# EAGLE design opendtu (EAGLE 7.7.0)
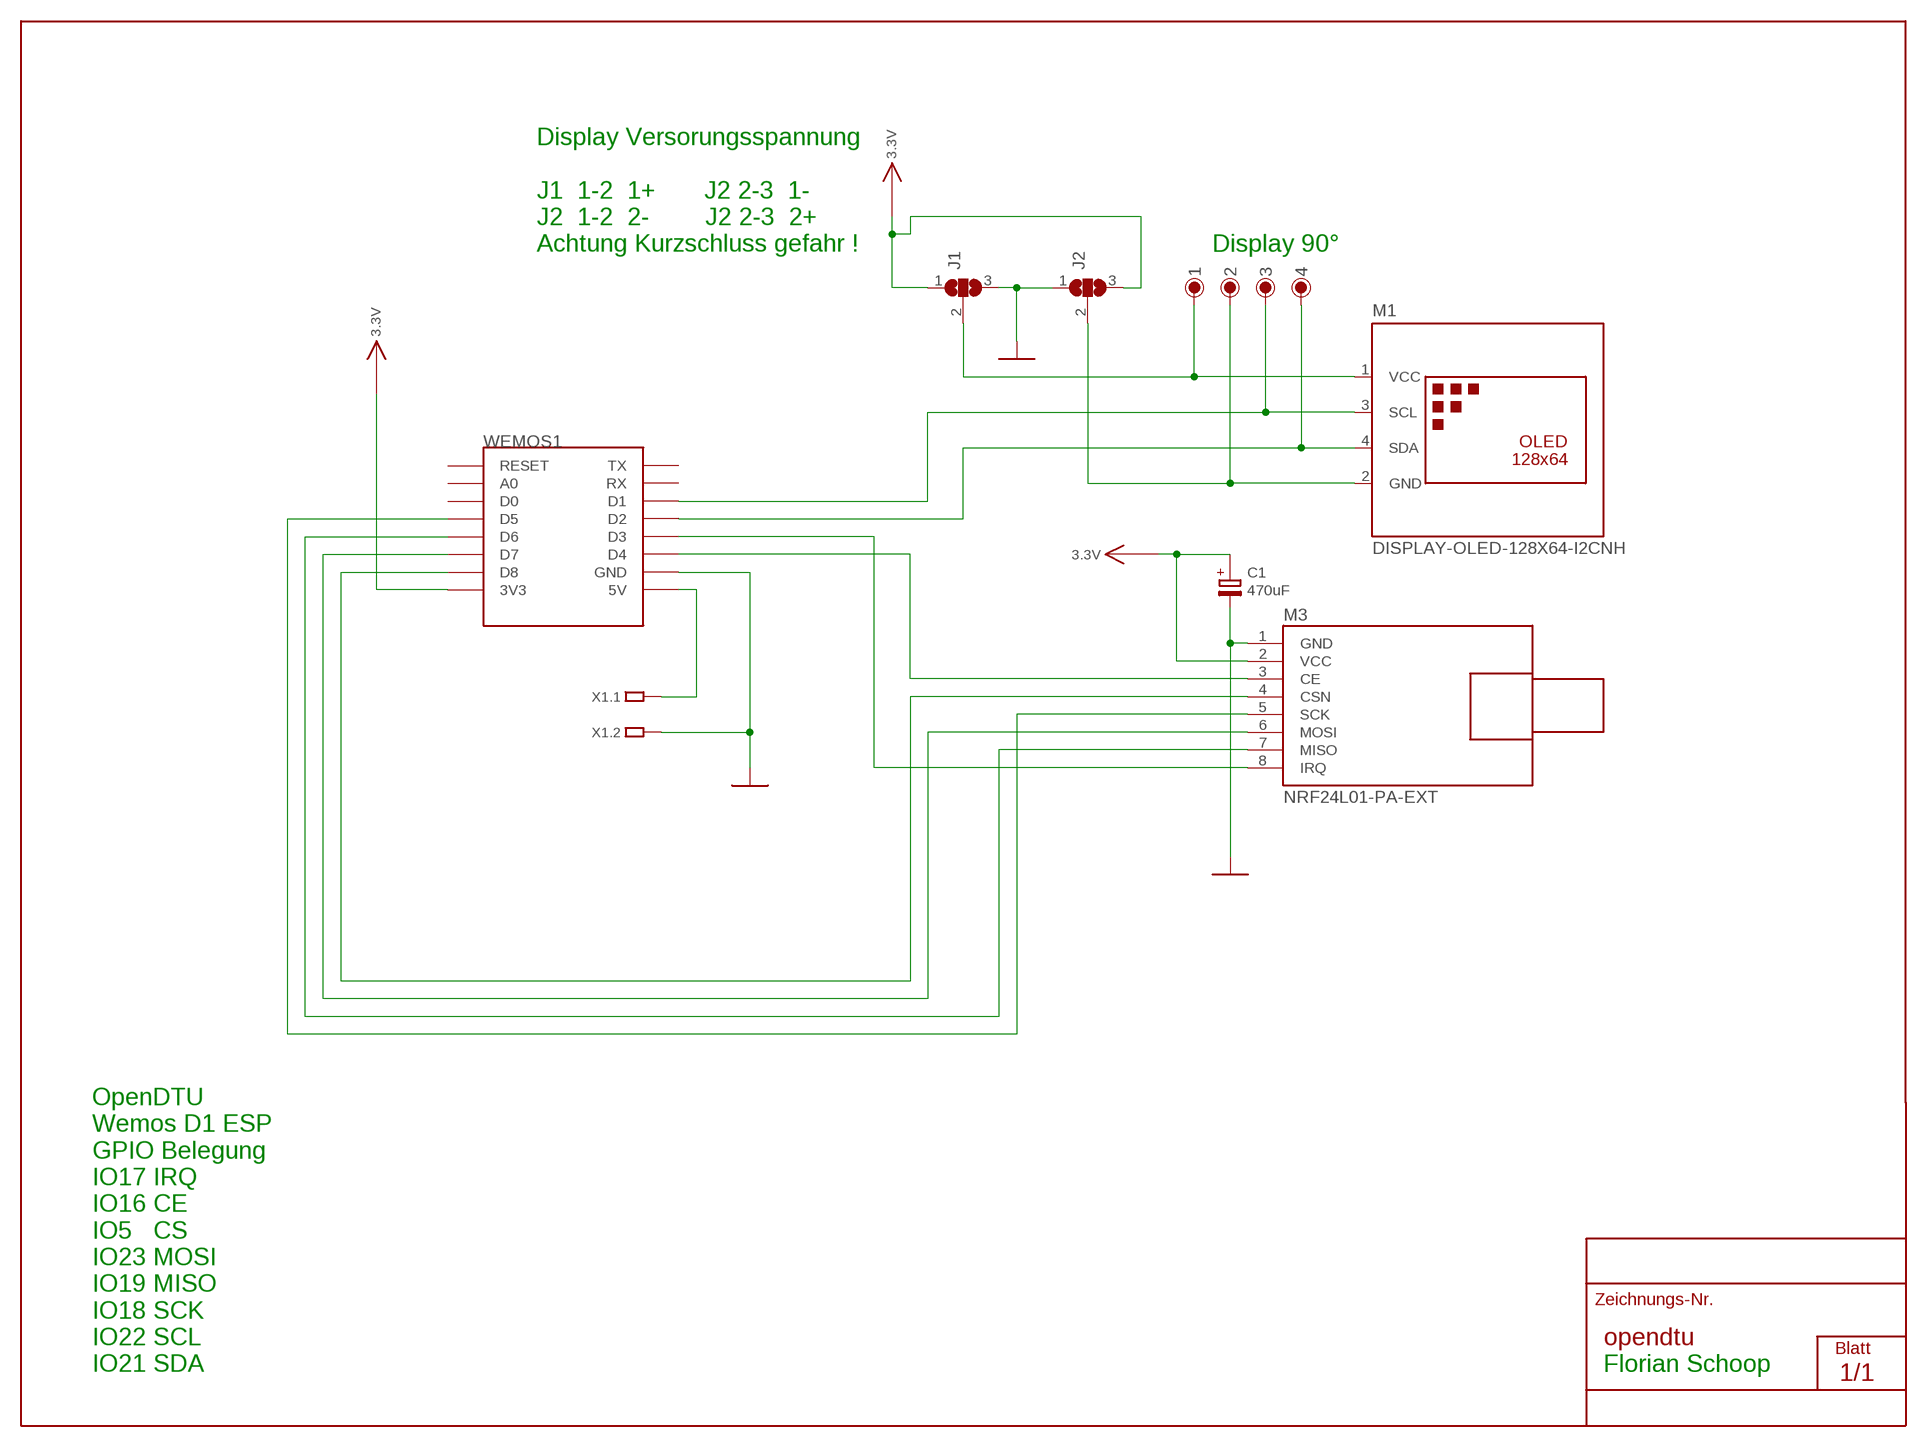
[diagram p0: schematic, sheet 1]

## Parts
1  PINGERAD  [PINGERAD]
2  PINGERAD  [PINGERAD]
3  PINGERAD  [PINGERAD]
4  PINGERAD  [PINGERAD]
C1  470uF  S470µ/16  [EB10D]
J1  SJ2W  [SJ_2]
J2  SJ2W  [SJ_2]
M1  DISPLAY-OLED-128X64-I2CNH  [DISPLAY-OLED-128X64-I2C_NH]
M3  NRF24L01-PA-EXT  [NRF24L01-PA-EXT]
WEMOS1  WEMOS-D1-MINI  [WEMOS-D1-MINI]
X1  MCV1,5/2G  [MCV1,5/2]

## Nets
+3.3V: C1.+ J1.1 J2.3 M3.2(VCC) WEMOS1.3V3 ; supply symbol labelled 3.3V
GND: C1.- J1.3 J2.1 M3.1(GND) WEMOS1.GND X1.2
N$1: 4.1 M1.4(SDA) WEMOS1.D2
N$2: 3.1 M1.3(SCL) WEMOS1.D1
N$3: 2.1 J2.2 M1.2(GND)
N$4: 1.1 J1.2 M1.1(VCC)
N$5: M3.3(CE) WEMOS1.D4
N$6: M3.4(CSN) WEMOS1.D8
N$7: M3.6(MOSI) WEMOS1.D7
N$8: M3.7(MISO) WEMOS1.D6
N$9: M3.5(SCK) WEMOS1.D5
N$11: M3.8(IRQ) WEMOS1.D3
N$12: WEMOS1.5V X1.1
Unconnected: WEMOS1.A0 WEMOS1.D0 WEMOS1.RESET WEMOS1.RX WEMOS1.TX

## Notes on the sheet
- Display Versorungsspannung
  
  J1  1-2  1+       J2 2-3  1-
  J2  1-2  2-        J2 2-3  2+
  Achtung Kurzschluss gefahr !
- Display 90°
- OpenDTU 
  Wemos D1 ESP
  GPIO Belegung
  IO17 IRQ
  IO16 CE
  IO5   CS
  IO23 MOSI
  IO19 MISO
  IO18 SCK
  IO22 SCL
  IO21 SDA
- Florian Schoop

## Library data of the parts
1-4 = 3PASSIVE:PINGERAD
C1 = 5elko:S470µ/16
J1 J2 = jumper_fs:SJ2W: SMD solder JUMPER
M1 = EYR_Displays:DISPLAY-OLED-128X64-I2C: 128x64 Dot Matrix OLED Module based on SSD1306 chip Variant with I2C interface
M3 = EYR_Modulos:NRF24L01-PA-EXT: 2.4 GHz Wireless Module based on NRF24L01 chip with preamplifier and external antenna
WEMOS1 = wemos d1:WEMOS-D1-MINI: WeMos.cc D1 mini ESP8266 module
X1 = STECKER:MCV1,5/2G

## Board
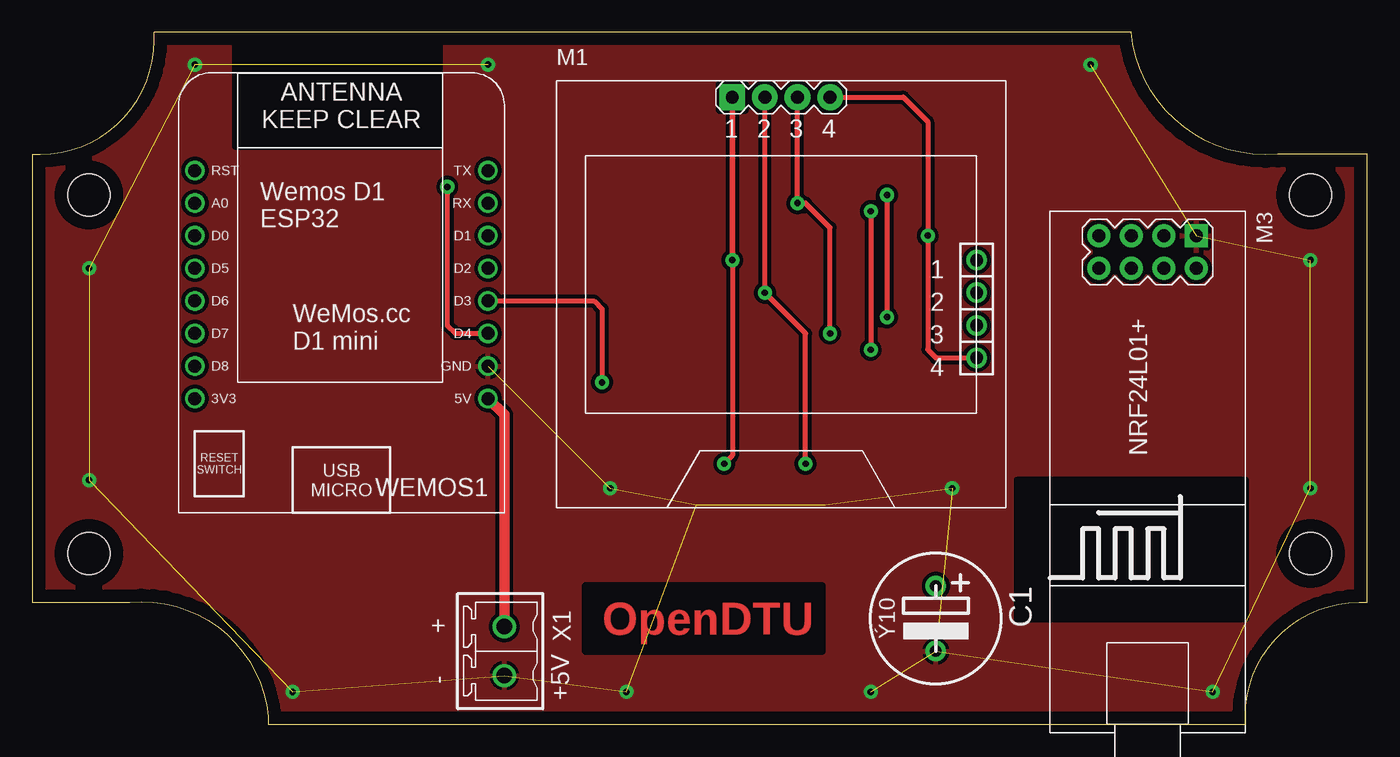
[diagram p1: board, top side]
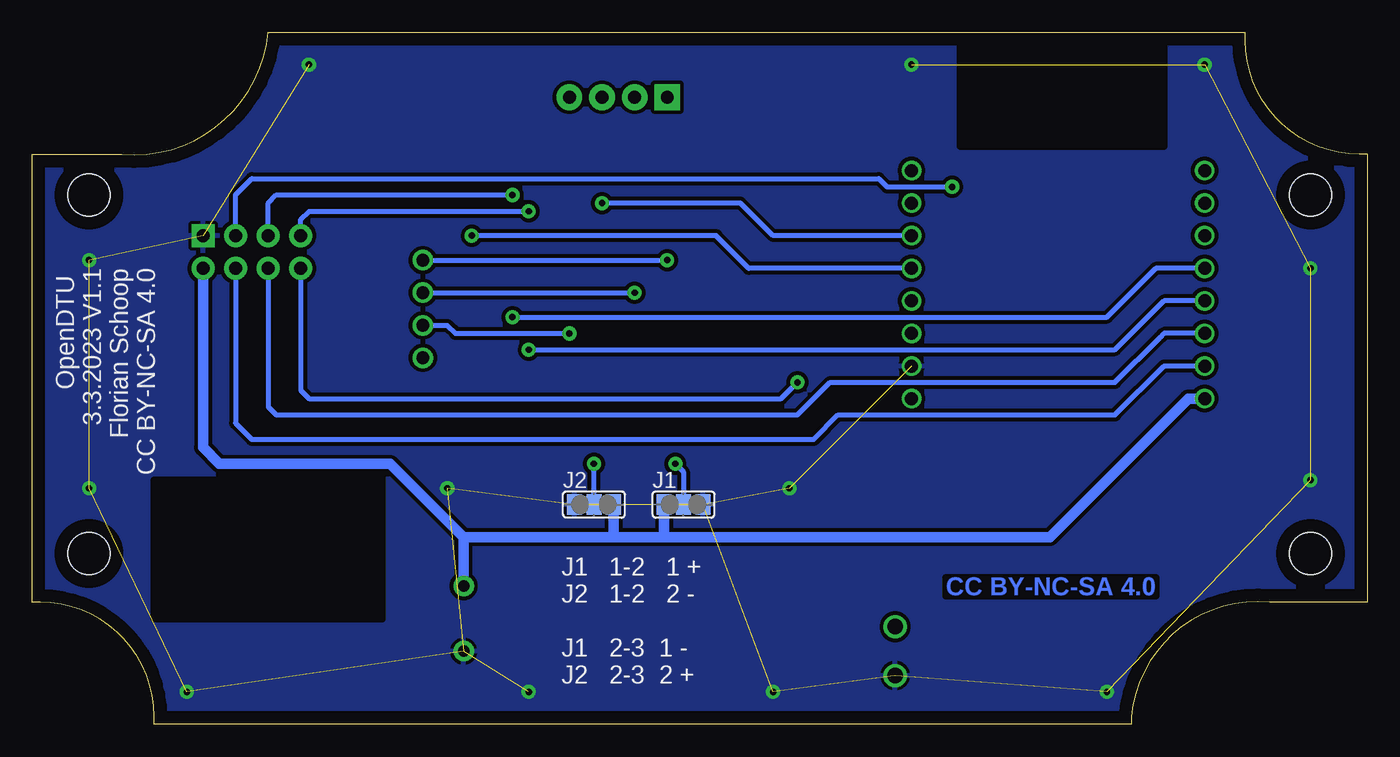
[diagram p2: board, bottom side, seen from below]

Size 104.14 x 53.98 mm. Coordinates in mm from the lower left corner, seen from the top.
Outline: 104.14,9.53 104.14,44.45 97.16,44.45 arc-90 85.72,53.98 9.53,53.98 9.53,53.34 arc-90 0.64,44.45 0,44.45 0,9.53 7.62,9.53 arc-90 18.41,0.64 18.41,0 94.61,0 94.61,0.64 arc-90 103.5,9.53 104.14,9.53
Copper layers (1*16): Component 0.035mm / dielectric 1.5mm / Solder 0.035mm
Design rules "default": minimum track width 10mil, minimum drill 0.6mm, track to track 8mil, track to pad 8mil, pad to pad 8mil, via to via 8mil, smd to smd 8mil, copper to edge 40mil, drill to drill 8mil, minimum pad ring 10mil, minimum via ring 8mil, stop-mask expansion 4mil, vias tented up to drill 0mil, thermal gap 10mil
Holes 3.3 mm at 4.45,41.27 4.45,13.34 99.69,41.27 99.69,13.34
tRestrict: area 15.9,45.1 to 31.7,54; area 76.8,8.3 to 94.6,19; area 43.2,5.7 to 61.6,10.8
bRestrict: area 15.9,45.1 to 31.7,54; area 76.8,8.3 to 94.6,19

### Footprints (pad centres in the part's own frame; a part is rotated, then mirrored left to right if it is on the bottom)
PINGERAD = drill 1 pad 1.6: 1 0,0
EB10D = drill 0.9 pad 1.6: + -2.54,0; - 2.54,0
SJ_2 = smd 1.168 x 1.6: 1 -1.524,0; 2 0,0; 3 1.524,0
DISPLAY-OLED-128X64-I2C_NH = drill 1 pad 2 square: 1 -3.81,12.7 | drill 1 pad 2: 2 -1.27,12.7; 3 1.27,12.7; 4 3.81,12.7
NRF24L01-PA-EXT = drill 1 pad 1.778 square: 1 -18.415,3.81 | drill 1.016 pad 1.778: 2 -15.875,3.81; 3 -18.415,1.27; 4 -15.875,1.27; 5 -18.415,-1.27; 6 -15.875,-1.27; 7 -18.415,-3.81; 8 -15.875,-3.81
WEMOS-D1-MINI = drill 1.016: 3V3 -10.16,-10.16; 5V 12.7,-10.16; A0 -10.16,5.08; D0 -10.16,2.54; D1 12.7,2.54; D2 12.7,0; D3 12.7,-2.54; D4 12.7,-5.08; D5 -10.16,0; D6 -10.16,-2.54; D7 -10.16,-5.08; D8 -10.16,-7.62; GND 12.7,-7.62; RESET -10.16,7.62; RX 12.7,5.08; TX 12.7,7.62
MCV1,5/2 = drill 1.2 pad 1.6: 1 0,0; 2 3.81,0

### Placement (x,y rotation side)
1  73.66,36.2 180 top
2  73.66,33.66 180 top
3  73.66,31.11 180 top
4  73.66,28.57 180 top
C1  70.48,8.26 270 top
J1  53.34,17.14 0 bottom
J2  60.33,17.14 0 bottom
M1  58.42,36.2 0 top
M3  86.99,19.68 270 top
WEMOS1  22.86,35.56 0 top
X1  36.83,7.62 270 top

### Tracks (layer width: path | path; a pad name or v marks a point on that pad's centre or on a via)
+3.3V
  Solder 0.4: 58.8,14.86 59.05,14.61 | 54.86,14.86 54.61,14.61
  Solder 0.8: 70.48,14.61 59.05,14.61 54.61,14.61 24.76,14.61 13.97,25.4 WEMOS1.3V3 | J2.3 58.8,14.86 | J1.1 54.86,14.86 | C1.+ 70.48,14.61 | M3.2 90.8,21.59 89.53,20.32 76.2,20.32 70.48,14.61
GND  (via drill 0.5 pad 1.1)  (18 unrouted)
  other vias: 45.09,18.41 71.75,18.41 12.7,51.44 82.55,51.44 20.32,2.54 92.07,2.54 4.45,19.05 4.45,35.56 35.56,51.44 99.69,36.2 99.69,18.41 65.41,2.54 46.36,2.54
  pour Component (isolate 0.3): 9.53,53.98 85.72,53.98 arc90 95.25,44.45 96.52,44.45 104.14,44.45 104.14,31.75 104.14,9.53 arc90 94.61,0 73.02,0 18.41,0 arc90 8.89,9.53 5.08,9.53 0,9.53 0,12.06 0,44.45 arc90
  pour Solder (isolate 0.3): 9.53,53.98 85.72,53.98 arc90 95.25,44.45 104.14,44.45 104.14,9.53 arc90 94.61,0 59.05,0 18.41,0 arc90 8.89,9.53 0,9.53 0,26.04 0,44.45 arc90
N$1  (via drill 0.5 pad 1.1)
  Component 0.4: 4.1 70.48,28.57 69.85,29.21 v69.85,38.1 69.85,46.99 67.94,48.9 M1.4
  Solder 0.4: v69.85,38.1 50.8,38.1 48.26,35.56 WEMOS1.D2
N$2  (via drill 0.5 pad 1.1)
  Component 0.4: M1.3 v59.69,40.64 60.33,40.64 62.23,38.73 v62.23,30.48
  Solder 0.4: WEMOS1.D1 46.36,38.1 48.9,40.64 v59.69,40.64 | 3.1 71.75,31.11 71.12,30.48 v62.23,30.48
N$3  (via drill 0.5 pad 1.1)
  Component 0.4: M1.2 v57.15,33.66 60.33,30.48 v60.33,20.32
  Solder 0.4: 2.1 v57.15,33.66 | J2.2 v60.33,20.32
N$4  (via drill 0.5 pad 1.1)
  Component 0.4: v54.61,36.2 M1.1 54.61,20.95 v53.98,20.32
  Solder 0.4: 1.1 v54.61,36.2 | v53.98,20.32 53.34,19.68 J1.2
N$5  (via drill 0.5 pad 1.1)
  Component 0.4: v32.39,41.91 32.39,31.11 33.02,30.48 WEMOS1.D4
  Solder 0.4: M3.3 88.27,41.27 86.99,42.55 38.1,42.55 37.47,41.91 v32.39,41.91
N$6
  Solder 0.4: M3.4 88.27,23.49 86.99,22.22 43.18,22.22 41.27,24.13 19.68,24.13 15.88,27.94 WEMOS1.D8
N$7
  Solder 0.4: M3.6 85.72,24.76 85.09,24.13 44.45,24.13 41.91,26.67 19.68,26.67 16.19,30.16 15.88,30.48 WEMOS1.D7
N$8  (via drill 0.5 pad 1.1)
  Component 0.4: v65.41,40.01 v65.41,29.21
  Solder 0.4: M3.7 83.18,39.37 82.55,40.01 v65.41,40.01 | v65.41,29.21 19.68,29.21 15.88,33.02 WEMOS1.D6
N$9  (via drill 0.5 pad 1.1)
  Component 0.4: v66.67,41.27 v66.67,31.75
  Solder 0.4: M3.5 85.72,40.64 85.09,41.27 v66.67,41.27 | v66.67,31.75 20.32,31.75 16.51,35.56 WEMOS1.D5
N$11  (via drill 0.5 pad 1.1)
  Component 0.4: WEMOS1.D3 43.82,33.02 44.45,32.39 v44.45,26.67
  Solder 0.4: M3.8 83.18,26.04 82.55,25.4 45.72,25.4 v44.45,26.67
N$12
  Component 0.8: X1.1 36.83,24.13 WEMOS1.5V

### Text on the board
Component: OpenDTU
Solder: CC BY-NC-SA 4.0
tNames: 1 | 2 | 3 | 4 | Wemos D1 / ESP32 | NRF24L01+ | + | - | +5V
bNames: OpenDTU / 3.3.2023 V1.1 / Florian Schoop / CC BY-NC-SA 4.0 | J1 1-2 1 + / J2 1-2 2 - / / J1 2-3 1 - / J2 2-3 2 +